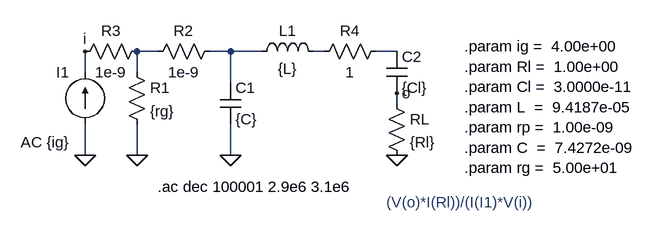
[diagram p0: schematic adaptadorL_ant_sinPerdidas.asc]
adaptadorL_ant_sinPerdidas.asc, the LTspice schematic file:
Version 4
SHEET 1 880 680
WIRE -16 -144 -48 -144
WIRE 96 -144 64 -144
WIRE 144 -144 96 -144
WIRE 240 -144 224 -144
WIRE 352 -144 320 -144
WIRE -128 -112 -128 -144
WIRE -48 -112 -48 -144
WIRE 96 -96 96 -144
WIRE 352 -64 352 -80
WIRE -128 16 -128 -32
WIRE -48 16 -48 -32
WIRE 96 16 96 -32
FLAG 352 16 0
FLAG 96 16 0
FLAG -48 16 0
FLAG -128 16 0
FLAG -128 -144 i
FLAG 352 -80 o
SYMBOL current -128 -32 R180
WINDOW 0 24 80 Left 2
WINDOW 3 24 0 Left 2
WINDOW 123 24 -28 Left 2
WINDOW 39 0 0 Left 0
SYMATTR InstName I1
SYMATTR Value ""
SYMATTR Value2 AC {ig}
SYMBOL res -64 -128 R0
SYMATTR InstName R1
SYMATTR Value {rg}
SYMBOL cap 80 -96 R0
SYMATTR InstName C1
SYMATTR Value {C}
SYMATTR SpiceLine Rser=0
SYMBOL ind 128 -128 R270
WINDOW 0 32 56 VTop 2
WINDOW 3 5 56 VBottom 2
SYMATTR InstName L1
SYMATTR Value {L}
SYMATTR SpiceLine Rser=0
SYMBOL res 336 -80 R0
SYMATTR InstName RL
SYMATTR Value {Rl}
SYMBOL cap 336 -144 R0
SYMATTR InstName C2
SYMATTR Value {Cl}
SYMBOL res -32 -128 R270
WINDOW 0 32 56 VTop 2
WINDOW 3 0 56 VBottom 2
SYMATTR InstName R2
SYMATTR Value 1e-9
SYMBOL res -32 -160 R90
WINDOW 0 0 56 VBottom 2
WINDOW 3 32 56 VTop 2
SYMATTR InstName R3
SYMATTR Value 1e-9
SYMBOL res 336 -160 R90
WINDOW 0 0 56 VBottom 2
WINDOW 3 32 56 VTop 2
SYMATTR InstName R4
SYMATTR Value 1
TEXT -16 64 Left 2 !.ac dec 100001 2.9e6 3.1e6
TEXT 336 88 Left 2 ;(V(o)*I(Rl))/(I(I1)*V(i))
TEXT 456 -152 Left 2 !.param ig =  4.00e+00 \n.param Rl =  1.00e+00 \n.param Cl =  3.0000e-11 \n.param L  =  9.4187e-05 \n.param rp =  1.00e-09 \n.param C  =  7.4272e-09 \n.param rg =  5.00e+01

The netlist it stands for:
* adaptadorL_ant_sinPerdidas.asc
I1 0 i AC {ig}
R1 N001 0 {rg}
C1 N002 0 {C} Rser=0
L1 N002 N003 {L} Rser=0
RL o 0 {Rl}
C2 N004 o {Cl}
R2 N001 N002 1e-9
R3 N001 i 1e-9
R4 N004 N003 1
.ac dec 100001 2.9e6 3.1e6
* (V(o)*I(Rl))/(I(I1)*V(i))
.param ig =  4.00e+00
.param Rl =  1.00e+00
.param Cl =  3.0000e-11
.param L  =  9.4187e-05
.param rp =  1.00e-09
.param C  =  7.4272e-09
.param rg =  5.00e+01
.backanno
.end